# Altium schematic sheet Power.SchDoc
size A4; Author: Thomas Kreppel; CompanyName: TU München; DrawnBy: Thomas Kreppel; Engineer: Eyke Liegmann; Organization: TUM EAL; Address1: Arcisstraße 21; Address2: 80333 München; Address3: GERMANY; SheetNumber: 6; SheetTotal: 6; CompanyName2: EAL
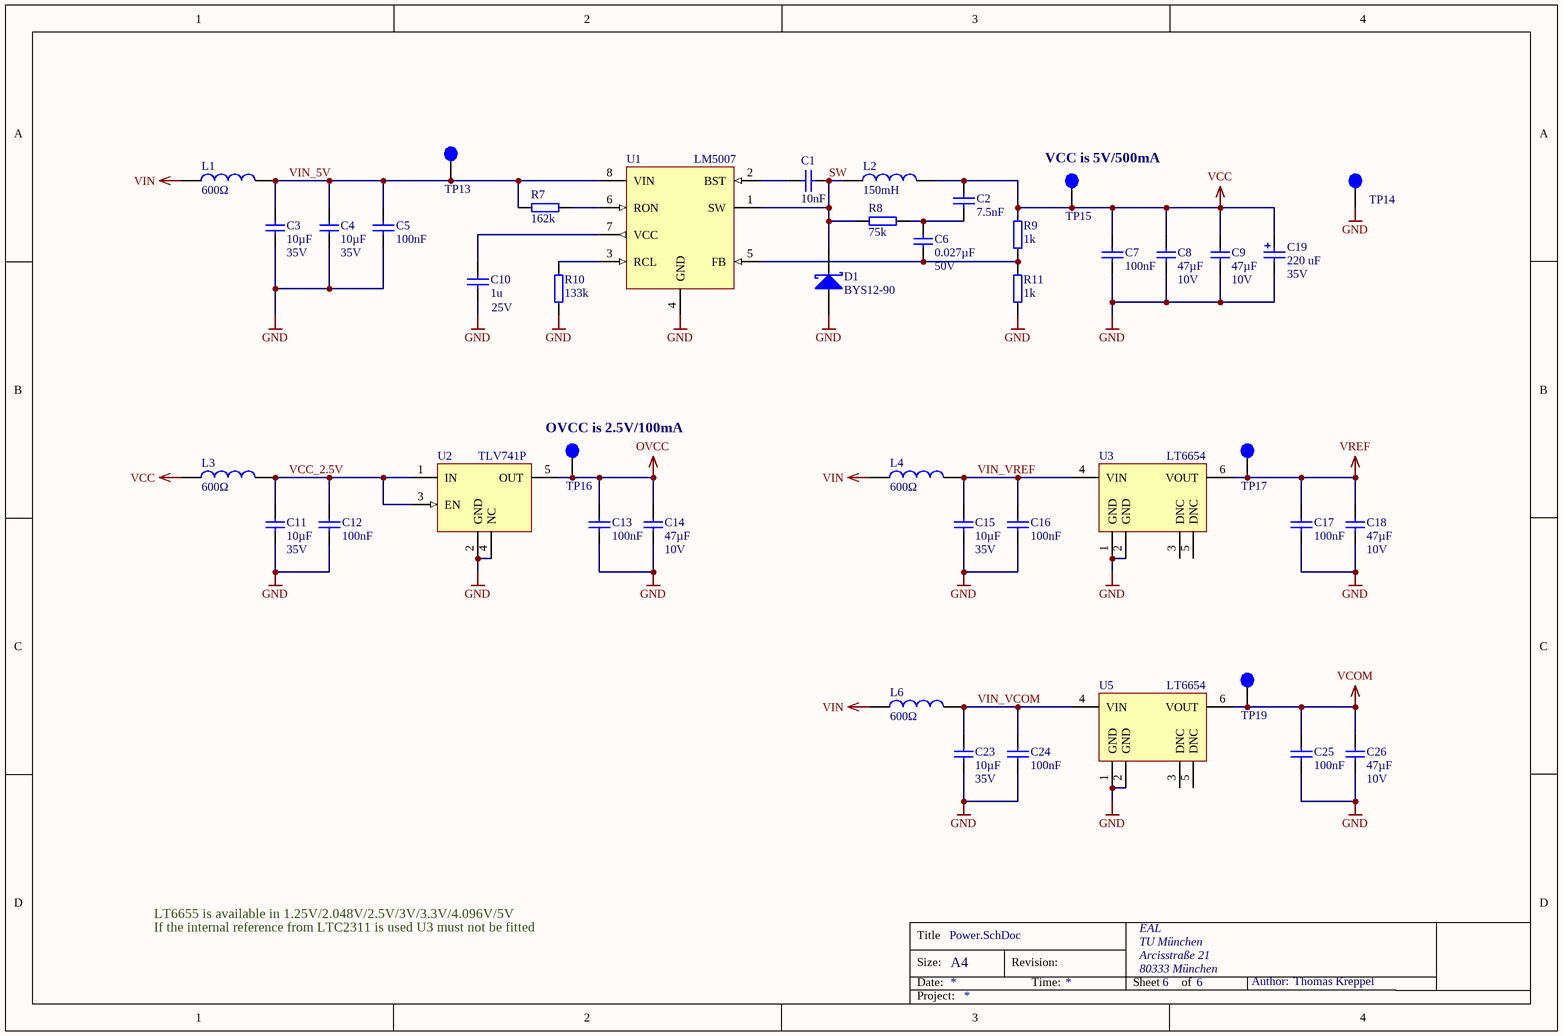
[diagram p0: Power.SchDoc]

## Parts
C1  10nF  [CAPC1608X07N]
C2  7.5nF  [CAPC1608X07N]
C3  10µF  Voltage: 35V  [C_1206]
C4  10µF  Voltage: 35V  [C_1206]
C5  100nF  [CAPC1608X07N]
C6  0.027µF  Voltage: 50V  [C_1206]
C7  100nF  [CAPC1608X07N]
C8  47µF  Voltage: 10V  [C_1206]
C9  47µF  Voltage: 10V  [C_1206]
C10  1u  Voltage: 25V  [CAPC1608X07N]
C11  10µF  Voltage: 35V  [C_1206]
C12  100nF  [CAPC1608X07N]
C13  100nF  [CAPC1608X07N]
C14  47µF  Voltage: 10V  [C_1206]
C15  10µF  Voltage: 35V  [C_1206]
C16  100nF  [CAPC1608X07N]
C17  100nF  [CAPC1608X07N]
C18  47µF  Voltage: 10V  [C_1206]
C19  220 uF  Voltage: 35V  [WCAP-ATG5_8x11.5x3.5]
C23  10µF  Voltage: 35V  [C_1206]
C24  100nF  [CAPC1608X07N]
C25  100nF  [CAPC1608X07N]
C26  47µF  Voltage: 10V  [C_1206]
D1  BYS12-90  [DIOM4227X23N]
L1  600Ω  [WE-CBF_0805_High Current]
L2  150mH  [SMT_inductor_1050_Performance]
L3  600Ω  [WE-CBF_0805_High Current]
L4  600Ω  [WE-CBF_0805_High Current]
L6  600Ω  [WE-CBF_0805_High Current]
R7  162k  [RESC1608X06N]
R8  75k  [RESC1608X06N]
R9  1k  [RESC1608X06N]
R10  133k  [RESC1608X06N]
R11  1k  [RESC1608X06N]
TP13  VIN  [TP_1mm]  (value not drawn)
TP14  GND  [TP_1mm]  (value not drawn)
TP15  VCC  [TP_1mm]  (value not drawn)
TP16  OVCC  [TP_1mm]  (value not drawn)
TP17  VREF  [TP_1mm]  (value not drawn)
TP19  VCOM  [TP_1mm]  (value not drawn)
U1  LM5007  [TSOP65P490X110-8N]
U2  TLV741P  [SOT95P250X110-5N]
U3  LT6654  [SOT95P280X100-6N]
U5  LT6654  [SOT95P280X100-6N]

## Nets
GND: C3.1 C4.1 C5.2 C7.1 C8.1 C9.1 C10.2 C11.1 C12.2 C13.2 C14.1 C15.1 C16.2 C17.2 C18.1 C19.2(N) C23.1 C24.2 C25.2 C26.1 D1.2(A) R10.1 R11.1 TP14.1 U1.4(GND) U2.2(GND) U2.4(NC) U3.1(GND) U3.2(GND) U5.1(GND) U5.2(GND)
OVCC: C13.1 C14.2 TP16.1 U2.5(OUT)
VCC: C2.1 C7.2 C8.2 C9.2 C19.1(P) L2.2 L3.1 R9.2 TP15.1
VCOM: C25.1 C26.2 TP19.1 U5.6(VOUT)
VIN: L1.1 L4.1 L6.1
VREF: C17.1 C18.2 TP17.1 U3.6(VOUT)
SW: C1.2 D1.1(K) L2.1 R8.1 U1.1(SW)
VCC_2.5V: C11.2 C12.1 L3.2 U2.1(IN) U2.3(EN)
VIN_5V: C3.2 C4.2 C5.1 L1.2 R7.1 TP13.1 U1.8(VIN)
VIN_VCOM: C23.2 C24.1 L6.2 U5.4(VIN)
VIN_VREF: C15.2 C16.1 L4.2 U3.4(VIN)
NetC1_1: C1.1 U1.2(BST)
NetC2_2: C2.2 C6.2 R8.2
NetC6_1: C6.1 R9.1 R11.2 U1.5(FB)
NetC10_1: C10.1 U1.7(VCC)
NetR7_2: R7.2 U1.6(RON)
NetR10_2: R10.2 U1.3(RCL)

Not connected (* = marked no-connect by the designer): U3 3(DNC) 5(DNC); U5 3(DNC) 5(DNC)

## Notes on the sheet
- (near TP15) VCC is 5V/500mA
- (near TP16) OVCC is 2.5V/100mA
- LT6655 is available in 1.25V/2.048V/2.5V/3V/3.3V/4.096V/5V
- If the internal reference from LTC2311 is used U3 must not be fitted
- Title
- Size:
- Date:
- A4
- Revision:
- Time:
- Sheet
- of
- Author:
- Project:

## Library data of the parts
C1 = Cap_0603: MPN: 885012206065; MF: Würth; Voltage: 25V; Dielectric: X7R; Value: 10nF; Supplier 1: Mouser; Supplier 2: *; Supplier Part Number 1: 710-885012206065; Supplier Part Number 2: *; Package: 0603
C2 = Cap_0603: MPN: C0603C752J3GACTU; MF: KEMET; Voltage: 25V; Dielectric: C0G; Value: 7.5nF; Supplier 1: Mouser; Supplier 2: *; Supplier Part Number 1: 80-C0603C752J3GACTU; Supplier Part Number 2: *; Package: 0603
C3 C4 C11 C15 C23 = C_1206: Capacitor 1206; MPN: GRM319R6YA106KA12D; Tolerance: 10%; MF: Murata Electronics; Dielectric: X5R; Package: 1206; Value: 10µF; Created: 2018_06_25_AGeiger; Supplier 1: Mouser; Supplier Part Number 1: 81-GRM319R6YA106KA2D
C5 C7 C12 C13 C16 C17 C24 C25 = Cap_0603: MPN: 885012206071; MF: Würth; Voltage: 25V; Dielectric: X7R; Value: 100nF; Supplier 1: Mouser; Supplier 2: *; Supplier Part Number 1: 710-885012206071; Supplier Part Number 2: *; Package: 0603
C6 = C_1206: Capacitor 1206; MPN: GRM3195C1H273JA01D; Tolerance: 5%; MF: Murata; Dielectric: C0G; Package: 1206; Value: 0.027µF; Created: 2018_06_25_AGeiger; Supplier 1: Mouser; Supplier Part Number 1: 81-GRM315C1H273JA01D
C8 C9 = C_1206: Capacitor 1206; MPN: GRM31CR61A476ME15L; Tolerance: 10%; MF: Murata Electronics; Dielectric: X5R; Package: 1206; Value: 47µF; Created: 2018_06_25_AGeiger; Supplier 1: Mouser; Supplier Part Number 1: 81-GRM31CR61A476ME5L
C10 = Cap_0603: MPN: 885012106022; MF: Würth; Dielectric: X5R; Value: 1u; Supplier 1: Mouser; Supplier 2: *; Supplier Part Number 1: 710-885012106022; Supplier Part Number 2: *; Package: 0603
C14 C18 C26 = C_1206: Capacitor 1206; MPN: GRM31CR61A476ME5L; Tolerance: 10%; MF: Murata Electronics; Dielectric: X5R; Package: 1206; Value: 47µF; Created: 2018_06_25_AGeiger; Supplier 1: Mouser; Supplier Part Number 1: 81-GRM31CR61A476ME5L
C19 = 860020574012: WCAP-ATG5 Aluminum Electrolytic Capacitors, 8x11.5mm, 35 Vdc, 220 uF; MF: Wurth Elektronik; ComponentLink1Description: Manufacturer; ComponentLink1URL: http://www.we-online.de; ComponentLink2Description: Datasheet; ComponentLink2URL: http://katalog.we-online.com/pbs/datasheet/860020574012.pdf; Part Number: 860020574012; Published Date: Sep. 2017; Size: 8x11.5mm; Life Cycle: 2000h; Operating Temperature: -40 °C up to +105 °C; Value: 220 uF; MPN: 860020574012; Supplier 1: Mouser; Supplier Part Number 1: 710-860020574012
D1 = BYS12-90: Schottky Diode; MPN: BYS12-90-E3/TR3; MF: Vishay; Forward Voltage: 750mV; Reverse Voltage: 90V; Rated Current: 1.5A; Package: DO-214AC; Supplier 1: Farnell; Supplier 2: Mouser; Supplier 3: Digi-Key; Supplier Part Number 1: 2889144; Supplier Part Number 2: 625-BYS12-90-E3/TR3; Supplier Part Number 3: BYS12-90-E3/GICT-ND
L1 L3 L4 L6 = WE-CBF, 742792040: WE-CBF SMD EMI Suppression Ferrite Bead, 0805, 600Ω; MF: Wurth Elektronik; Type: High Current; PublishedDate: Aug 2016; ComponentLink1Description: Manufacturer; ComponentLink1URL: http://www.we-online.de; ComponentLink2Description: Datasheet; ComponentLink2URL: http://katalog.we-online.de/pbs/datasheet/742792040.pdf; MPN: 742792040; Value: 600Ω; Size: 0805; Supplier 1: Farnell; Supplier 2: Mouser; Supplier 3: Digi-Key; Supplier Part Number 1: 2761567; Supplier Part Number 2: 710-742792040; Supplier Part Number 3: 732-1620-1-ND
L2 = B82464G4154M: SMT power Inductor, 150uH, 320m DRC; MF: EPCOS / TDK; Rated Current: 0.85 A; MPN: B82464G4154M; Supplier 1: Mouser; Supplier Part Number 1: 871-B82464G4154M; Value: 150mH; DCR: 320m
R7 = R_0603: MPN: CR0603-FX-1623ELF; MF: Bourns; Value: 162k; Supplier 1: Mouser; Supplier Part Number 1: 652-CR0603-FX1623ELF; Package: 0603
R8 = R_0603: MPN: AC0603FR-1375KL; MF: Yageo; Value: 75k; Supplier 1: Mouser; Supplier Part Number 1: 603-AC0603FR-1375KL; Package: 0603
R9 R11 = R_0603: MPN: CRCW06031K00JNEAC; MF: Vishay / Dale; Value: 1k; Supplier 1: Mouser; Supplier Part Number 1: 71-CRCW06031K00JNEAC; Package: 0603
R10 = R_0603: MPN: CR0603-FX-1333ELF; MF: Bourns; Value: 133k; Supplier 1: Mouser; Supplier Part Number 1: 652-CR0603FX-1333ELF; Package: 0603
TP13-TP17 TP19 = TP_1mm: Testpoint 1mm; Created: 2018_06_25_AGeiger; Value: Testpoint 1mm
U1 = LM5007: Buck Converter, 9-75Vin, 2.5-73Vout; MPN: LM5007MM/NOPB; MF: Texas Instruments; Supplier 1: Farnell; Supplier 2: Mouser; Supplier 3: Digi-Key; Supplier Part Number 1: 9779345; Supplier Part Number 2: 926-LM5007MM/NOPB; Supplier Part Number 3: LM5007MM/NOPBCT-ND; Package: VSSOP-8
U2 = TLV741P: 150mA, 2.5V LDO; MPN: TLV74125PDBVR; MF: Texas Instruments; Supplier 1: Mouser; Supplier 2: Digi-Key; Supplier Part Number 1: 595-TLV74125PDBVR; Supplier Part Number 2: 296-49999-1-ND; Package: SOT-23-5
U3 U5 = LT6654: MPN: LT6654AIS6-5#TRMPBF; MF: Analog Devices; Package: TSOT-23-6; Supplier 1: Farnell; Supplier 2: Mouser; Supplier 3: Digi-Key; Supplier Part Number 1: 2761960; Supplier Part Number 2: 584-6654AIS65TRMPBF; Supplier Part Number 3: LT6654AIS6-5#TRMPBFCT-ND